# Altium schematic sheet ARM_EURO_Platine1.SchDoc
size A3; PageSetup: Record=PageOptions|CenterHorizontal=True|CenterVertical=True|PrintScale=0.73|XCorrection=1.00|YCorrection=1.00|PrintKind=0|BorderSize=5000000|LeftOffset=0|BottomOffset=0|Orientation=2|PaperLength=1000|PaperWidth=1000|Scale=100|PaperSource=7|PrintQuality=-3|MediaType=1|DitherType=10|PrintScaleMode=1|PaperKind=A4|PaperIndex=9
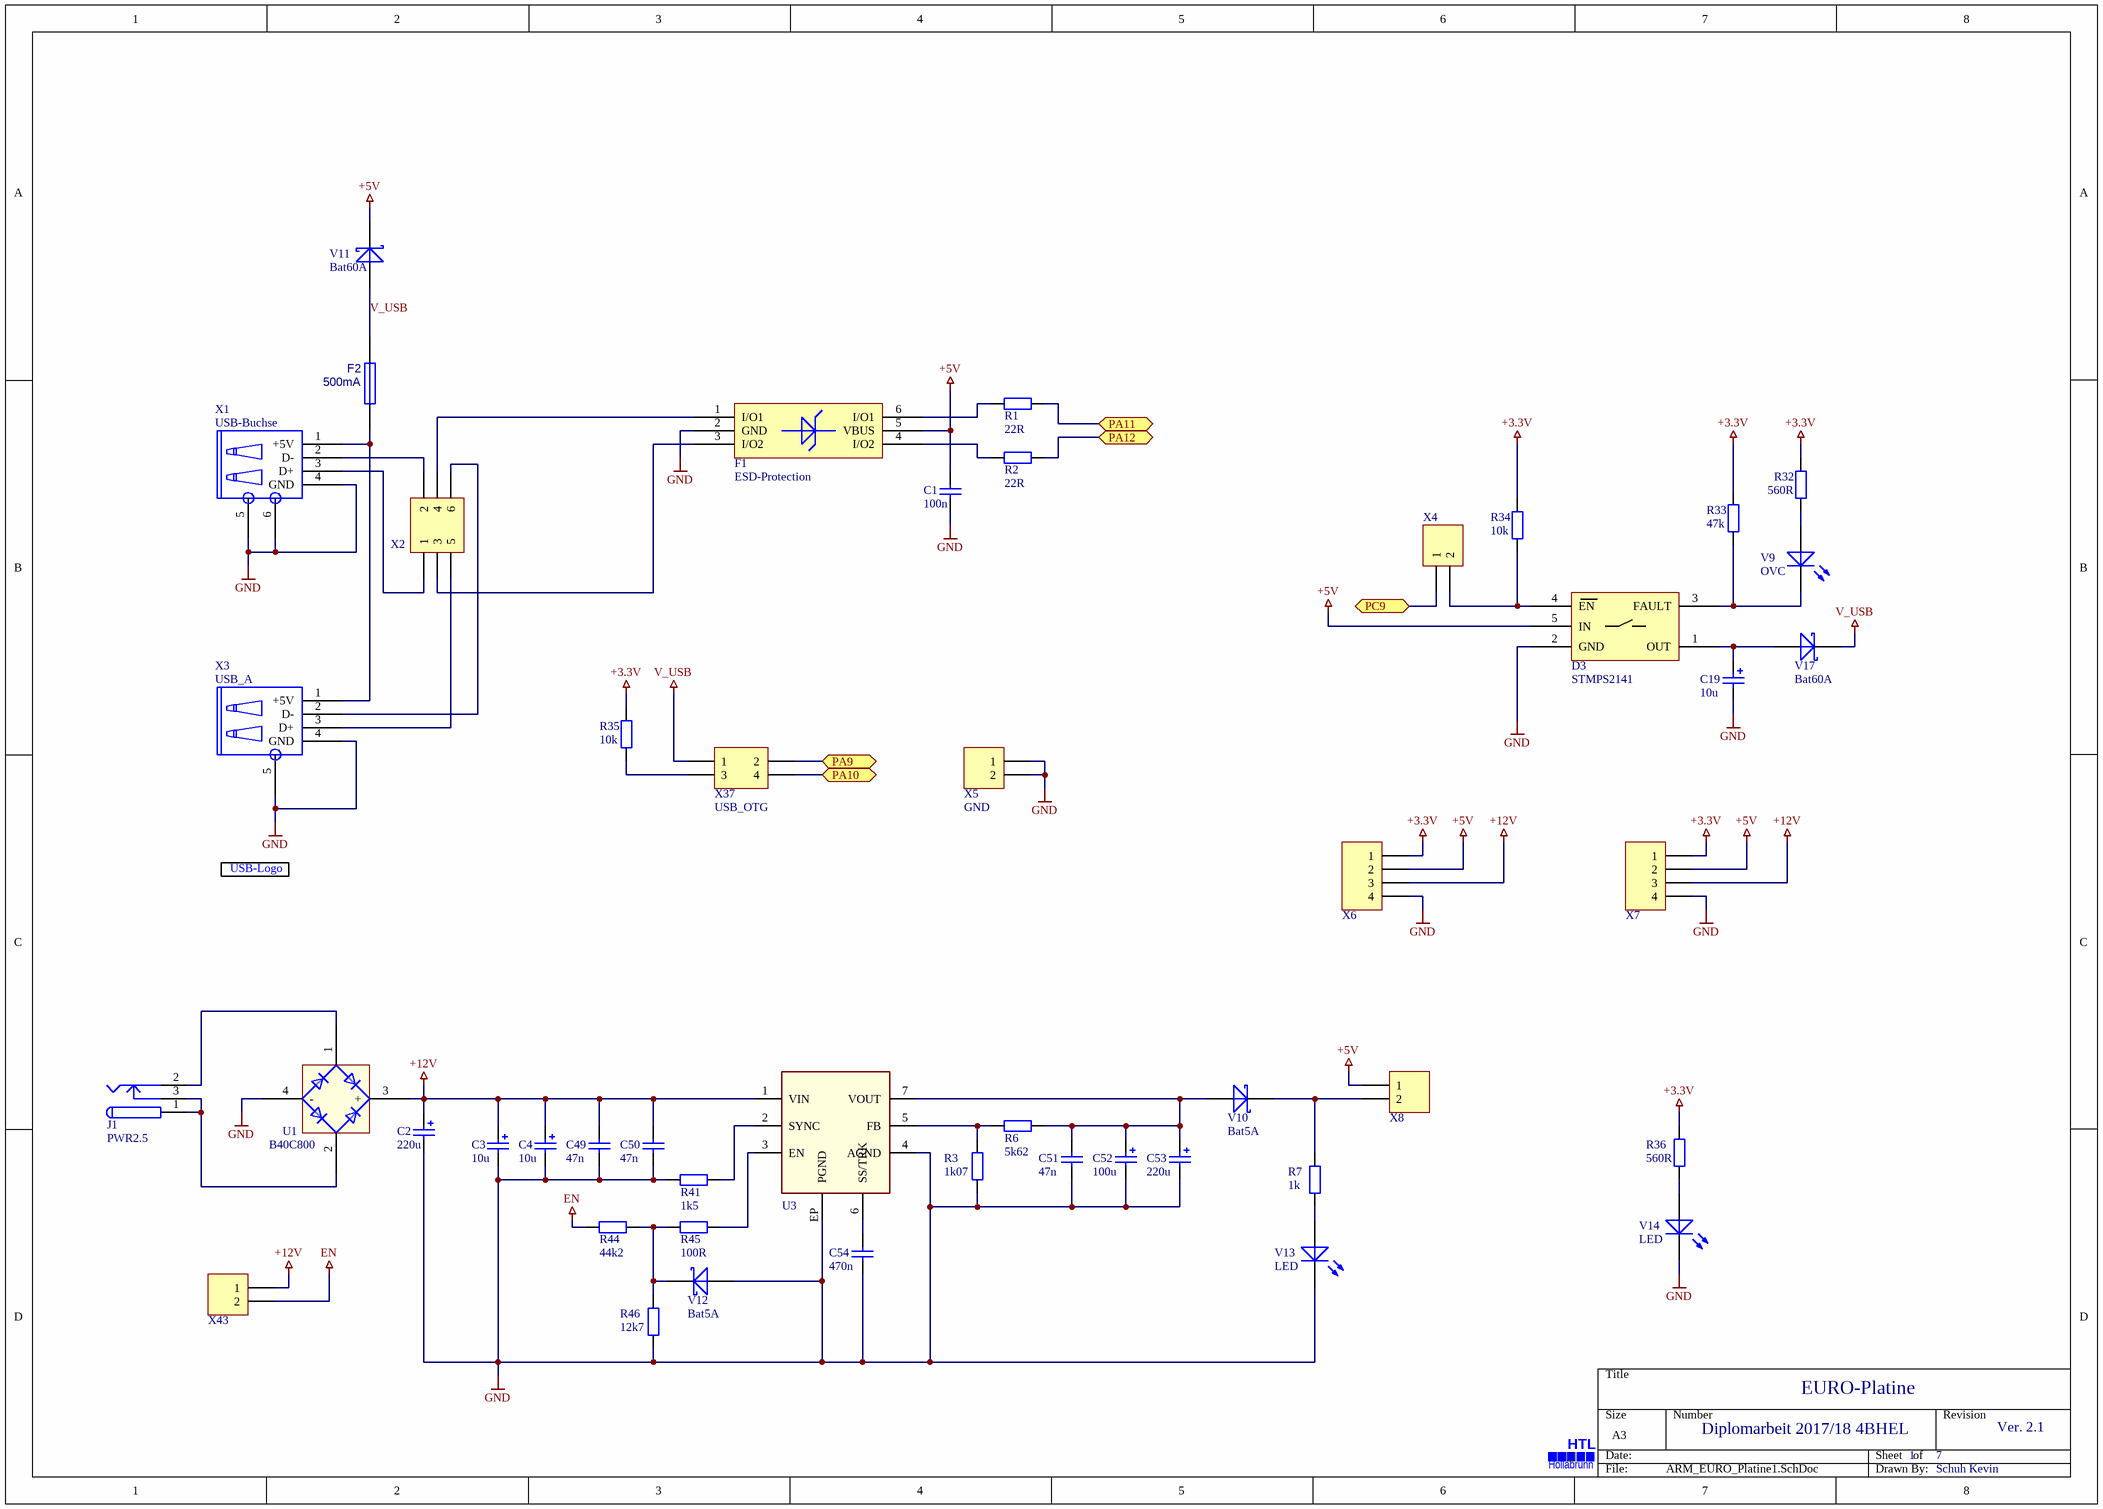
[diagram p0: ARM_EURO_Platine1.SchDoc]

## Parts
*1  USB_Logo  [USB_Logo]  (value not drawn)
A1  HTL Hollabrunn  [HTL_Logo]  (value not drawn)
C1  value 100n  [0805_CAP]  (hidden comment: Cap_Keramik_SMD)
C2  value 220u  [100µF_16V_Kondensator]  (hidden comment: Cap_Pol_SMD)
C3  value 10u  [1411_Cap_Pol_Tantal]  (hidden comment: Cap_Pol_Tantal)
C4  value 10u  [1411_Cap_Pol_Tantal]  (hidden comment: Cap_Pol_Tantal)
C19  value 10u  [100µF_16V_Kondensator]  (hidden comment: Cap_Pol_SMD)
C49  value 47n  [0805_CAP]  (hidden comment: Cap_Keramik_SMD)
C50  value 47n  [0805_CAP]  (hidden comment: Cap_Keramik_SMD)
C51  value 47n  [0805_CAP]  (hidden comment: Cap_Keramik_SMD)
C52  value 100u  [100µF_16V_Kondensator]  (hidden comment: Cap_Pol_SMD)
C53  value 220u  [100µF_16V_Kondensator]  (hidden comment: Cap_Pol_SMD)
C54  value 470n  [0805_CAP]  (hidden comment: Cap_Keramik_SMD)
D3  STMPS2141  [STMPS2141]
F1  ESD-Protection  [USBLC6_2]
F2  500mA  [Polyfuse]
J1  PWR2.5  [PowerJack]
R1  value 22R  [0805_Res]  (hidden comment: Res_SMD)
R2  value 22R  [0805_Res]  (hidden comment: Res_SMD)
R3  value 1k07  [0805_Res]  (hidden comment: Res_SMD)
R6  value 5k62  [0805_Res]  (hidden comment: Res_SMD)
R7  value 1k  [0805_Res]  (hidden comment: Res_SMD)
R32  value 560R  [0805_Res]  (hidden comment: Res_SMD)
R33  value 47k  [0805_Res]  (hidden comment: Res_SMD)
R34  value 10k  [0805_Res]  (hidden comment: Res_SMD)
R35  value 10k  [0805_Res]  (hidden comment: Res_SMD)
R36  value 560R  [0805_Res]  (hidden comment: Res_SMD)
R41  value 1k5  [0805_Res]  (hidden comment: Res_SMD)
R44  value 44k2  [0805_Res]  (hidden comment: Res_SMD)
R45  value 100R  [0805_Res]  (hidden comment: Res_SMD)
R46  value 12k7  [0805_Res]  (hidden comment: Res_SMD)
U1  B40C800  [Diodengleichrichter]
U3  171050601  [TO263-7EP]  (value not drawn)
V9  OVC  [0805_LED]
V10  Bat5A  [BAT254_Schottky]
V11  Bat60A  [BAT254_Schottky]
V12  Bat5A  [BAT254_Schottky]
V13  LED  [0805_LED]
V14  LED  [0805_LED]
V17  Bat60A  [BAT254_Schottky]
X1  USB-Buchse  [USB_B]
X2  Header_3x2  [HDR2X3]  (value not drawn)
X3  USB_A  [USB_A]
X4  Header  [HDR1X2]  (value not drawn)
X5  GND  [HDR1X2]
X6  Header_4  [HDR1X4]  (value not drawn)
X7  Header_4  [HDR1X4]  (value not drawn)
X8  Header  [HDR1X2]  (value not drawn)
X37  USB_OTG  [HDR2X2]
X43  Header  [HDR1X2]  (value not drawn)

## Ports
PA9, PA10, PA11, PA12, PC9

## Nets
+3.3V: R32.2 R33.2 R34.2 R35.2 R36.2 X6.1 X7.1
+5V: C1.2 D3.5(IN) F1.5(VBUS) V11.1 X6.2 X7.2 X8.1
+12V: C2.1 C3.1 C4.1 C49.2 C50.1 U1.3(+) U3.1(VIN) X6.3 X7.3 X43.1
EN: R44.2 X43.2
GND: C1.1 C2.2 C3.2 C4.2 C19.2 C49.1 C50.2 C51.2 C52.2 C53.2 C54.2 D3.2(GND) F1.2(GND) R3.1 R41.2 R46.1 U1.4(-) U3.4(AGND) U3.EP(PGND) V12.2 V13.2(K) V14.2(K) X1.4(GND) X1.5(GND) X1.6(GND) X3.4(GND) X3.5(GND) X5.1 X5.2 X6.4 X7.4
V_USB: F2.2 V11.2 V17.1 X37.1
PA9: X37.2 ; port PA9
PA10: X37.4 ; port PA10
PA11: R1.2 ; port PA11
PA12: R2.2 ; port PA12
PC9: X4.1 ; port PC9
NetC19_1: C19.1 D3.1(OUT) V17.2
NetC51_1: C51.1 C52.1 C53.1 R6.1 U3.7(VOUT) V10.2
NetC54_1: C54.1 U3.6(SS/TRK)
NetD3_3: D3.3(FAULT) R33.1 V9.2(K)
NetD3_4: D3.4(EN) R34.1 X4.2
NetF1_1: F1.1(I/O1) X2.4
NetF1_3: F1.3(I/O2) X2.3
NetF1_4: F1.4(I/O2) R2.1
NetF1_6: F1.6(I/O1) R1.1
NetF2_1: F2.1 X1.1(+5V) X3.1(+5V)
NetJ1_1: J1.1 J1.3 U1.2
NetJ1_2: J1.2 U1.1
NetR3_2: R3.2 R6.2 U3.5(FB)
NetR7_1: R7.1 V13.1(A)
NetR7_2: R7.2 V10.1 X8.2
NetR32_1: R32.1 V9.1(A)
NetR35_1: R35.1 X37.3
NetR36_1: R36.1 V14.1(A)
NetR41_1: R41.1 U3.2(SYNC)
NetR44_1: R44.1 R45.2 R46.2 V12.1
NetR45_1: R45.1 U3.3(EN)
NetX1_2: X1.2(D-) X2.2
NetX1_3: X1.3(D+) X2.1
NetX2_5: X2.5 X3.3(D+)
NetX2_6: X2.6 X3.2(D-)

## Notes on the sheet
- EURO-Platine
- Diplomarbeit 2017/18 4BHEL
- 1
- 7
- Ver. 2.1
- Schuh Kevin
- (in symbol HTL_Logo) HTL; Hollabrunn
- (in symbol USB_Logo) USB-Logo

## Library data of the parts
*1 = USB_Logo: Logo
A1 = HTL_Logo
C1 C49-C51 C54 = Cap_Keramik_SMD: Capacitor_SMD; Published: 8-Jun-2000; LatestRevisionDate: 17-Jul-2002; LatestRevisionNote: Re-released for DXP Platform.; PackageReference: RAD-0.3; Publisher: Altium Limited
C2 C19 C52 C53 = Cap_Pol_SMD: Polarized Capacitor SMD; Published: 8-Jun-2000; LatestRevisionDate: 17-Jul-2002; LatestRevisionNote: Re-released for DXP Platform.; PackageReference: RB7.6-15; Publisher: Altium Limited
C3 C4 = Cap_Pol_Tantal: Polarized Capacitor; Published: 8-Jun-2000; LatestRevisionDate: 17-Jul-2002; LatestRevisionNote: Re-released for DXP Platform.; PackageReference: RB7.6-15; Publisher: Altium Limited
D3 = STMPS2141: Power Switch
F1 = USBLC6_2: Schutz vor entladungen über USB-Buchse
F2 = Fuse: Published: 8-Jun-2000; LatestRevisionDate: 17-Jul-2002; LatestRevisionNote: Re-released for DXP Platform.; PackageReference: PIN-W2/E2.8; Publisher: Altium Limited
J1 = PWR2.5: Low Voltage Power Supply Connector; Published: 17-Dec-2003; DatasheetDocument: 09-May-2002; Publisher: Altium Limited; ComponentLink1Description: Manufacturer Link; ComponentLink1URL: http://domino.kycon.com/internet/Products.html
R1-R3 R6 R7 R32-R36 R41 R44-R46 = Res_SMD: Resistor; Published: 8-Jun-2000; LatestRevisionDate: 17-Jul-2002; LatestRevisionNote: Re-released for DXP Platform.; PackageReference: AXIAL-0.4; Publisher: Altium Limited
U1 = Brueckengleichrichter
U3 = 171050601: VDRM Variable Step Down Regulator Module, TO263-7EP; OutputCurrent: 5A; InputVoltage: 6-36 V(DC); PublishedDate: Aug 2016; Publisher: Wurth Elektronik; ComponentLink1Description: Manufacturer; ComponentLink1URL: http://www.we-online.de; ComponentLink2Description: Datasheet; ComponentLink2URL: http://katalog.we-online.de/pm/datasheet/171050601.pdf; PartNumber: 171050601; Size: TO263-7EP
V9 V13 V14 = LED_SMD: Typical RED, GREEN, YELLOW, AMBER GaAs LED; Published: 8-Jun-2000; LatestRevisionDate: 17-Jul-2002; LatestRevisionNote: Re-released for DXP Platform.; PackageDocument: Feb-2002; PackageReference: 3.2X1.6X1.1; Publisher: Altium Limited
V10-V12 V17 = Bat60A: Diode
X1 = USB_Buchse_B: USB Buchse (B)
X2 = Header_3x2: Header, 3x2-Pin; LatestRevisionDate: 17-Jul-2002; LatestRevisionNote: Re-released for DXP Platform.; Publisher: Altium Limited
X3 = USB_Buchse_A: USB Buchse (A)
X4 X8 X43 = Header_2: Header, 2-Pin; LatestRevisionDate: 17-Jul-2002; LatestRevisionNote: Re-released for DXP Platform.; Publisher: Altium Limited
X5 = Masseschleife: Header, 2-Pin; LatestRevisionDate: 17-Jul-2002; LatestRevisionNote: Re-released for DXP Platform.; Publisher: Altium Limited
X6 X7 = Header_4: Header, 3-Pin; LatestRevisionDate: 17-Jul-2002; LatestRevisionNote: Re-released for DXP Platform.; Publisher: Altium Limited
X37 = Header_2x2: Header, 3x2-Pin; LatestRevisionDate: 17-Jul-2002; LatestRevisionNote: Re-released for DXP Platform.; Publisher: Altium Limited